# Altium schematic sheet 12V_Power_Supply.SchDoc
size B
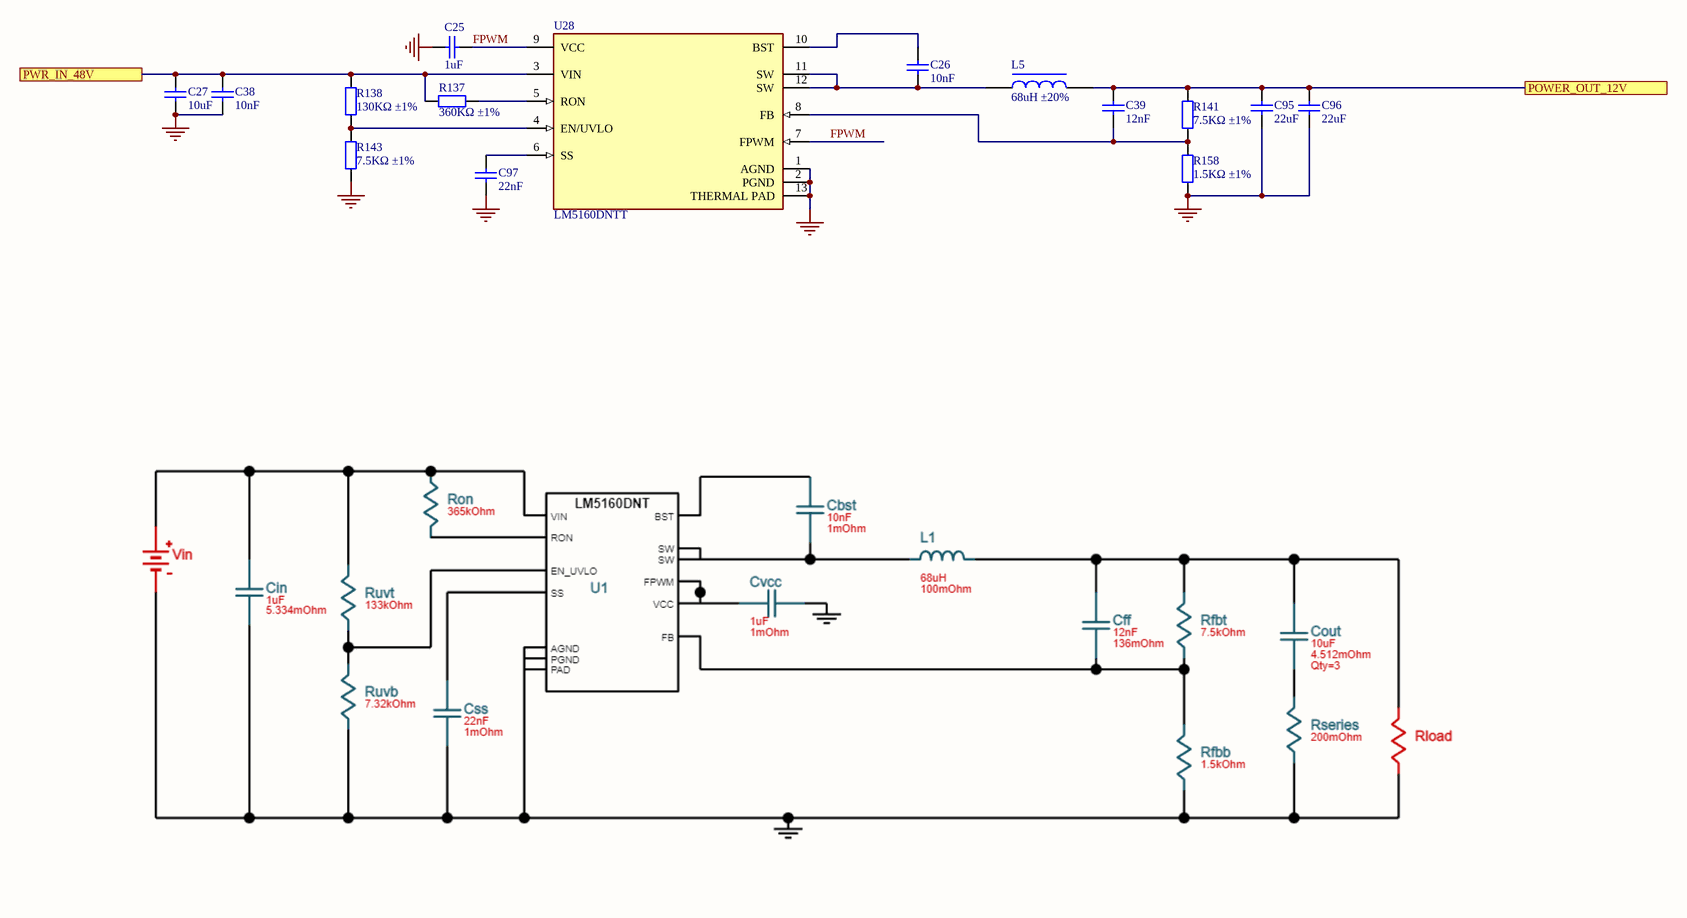
[diagram p0: 12V_Power_Supply.SchDoc]

## Parts
C25  1uF  [0603_C]
C26  10nF  [0603_C]
C27  10uF  [1206_C]
C38  10nF  [0603_C]
C39  12nF  [0603_C]
C95  22uF  [0805_C]
C96  22uF  [0805_C]
C97  22nF  [0603_C]
L5  68uH ±20%  [INDP126126X68N]
R137  360KΩ ±1%  [0603_R]
R138  130KΩ ±1%  [0603_R]
R141  7.5KΩ ±1%  [0603_R]
R143  7.5KΩ ±1%  [0603_R]
R158  1.5KΩ ±1%  [0603_R]
U28  LM5160DNTT  [FP-DNT0012B-MFG]

## Ports
POWER_OUT_12V, PWR_IN_48V

## Nets
GND: C25.1 C27.1 C38.1 C95.1 C96.1 C97.1 R143.1 R158.1 U28.1(AGND) U28.2(PGND) U28.13(THERMAL_PAD)
FPWM: C25.2 U28.7(FPWM) U28.9(VCC)
POWER_OUT_12V: C39.2 C95.2 C96.2 L5.2 R141.2 ; port POWER_OUT_12V
PWR_IN_48V: C27.2 C38.2 R137.1 R138.2 U28.3(VIN) ; port PWR_IN_48V
NetC26_1: C26.1 U28.10(BST)
NetC26_2: C26.2 L5.1 U28.11(SW) U28.12(SW)
NetC39_1: C39.1 R141.1 R158.2 U28.8(FB)
NetC97_2: C97.2 U28.6(SS)
NetR137_2: R137.2 U28.5(RON)
NetR138_1: R138.1 R143.2 U28.4(EN/UVLO)

## Notes on the sheet
- SHEET
- Expatria Technologies
- 1136 Glade Court
- Port Coquitlam, BC V3B 1R5
- PHONE: (778) 238-9336
- PROJECT
- SIZE
- ENGR
- MODIFIED
- DOCUMENT
- REV
- This document contains confidential and proprietary information. No disclosure, reproduction, or transfer of this material in part or in its entirety shall be done without prior written approval.
- EMAIL: INFO@EXPATRIA.CA
- B
- /

## Library data of the parts
C25 = 0603 1uF (105) 10% 50V: Chip capacitors; Manufacturer: Samsung Electro-Mechanics; PartNumber: CL10A105KB8NNNC; Tolerance: 10%; Voltage: 50V; ComponentLink1Description: Supplier link; ComponentLink1URL: http://www.szlcsc.com/product/details_16531.html; Package: 0603; Supplier: LC; SuppliersPartNumber: C15849; Capacitance: 1uF
C26 C38 = 0603 10nF (103) 10% 50V: Chip capacitors; Manufacturer: Guangdong Fenghua Advanced Tech; PartNumber: 0603B103K500NT; Tolerance: 10%; Voltage: 50V; ComponentLink1Description: Supplier link; ComponentLink1URL: http://www.szlcsc.com/product/details_58143.html; Package: 0603; Supplier: LC; SuppliersPartNumber: C57112; Capacitance: 10nF
C27 = 1206 10uF (106) 10% 50V: Chip capacitors; Manufacturer: Samsung Electro-Mechanics; PartNumber: CL31A106KBHNNNE; Tolerance: 10%; Voltage: 50V; ComponentLink1Description: Supplier link; ComponentLink1URL: http://www.szlcsc.com/product/details_14236.html; Package: 1206; Supplier: LC; SuppliersPartNumber: C13585; Capacitance: 10uF
C39 = 0603 12nF (123) 10% 50V: Chip capacitors; Manufacturer: Guangdong Fenghua Advanced Tech; PartNumber: 0603B123K500NT; Tolerance: 10%; Voltage: 50V; ComponentLink1Description: Supplier link; ComponentLink1URL: http://www.szlcsc.com/product/details_1945.html; Package: 0603; Supplier: LC; SuppliersPartNumber: C1593; Capacitance: 12nF
C95 C96 = 0805 22uF (226) 20% 25V: Chip capacitors; Manufacturer: Samsung Electro-Mechanics; PartNumber: CL21A226MAQNNNE; Tolerance: 20%; Voltage: 25V; ComponentLink1Description: Supplier link; ComponentLink1URL: http://www.szlcsc.com/product/details_46786.html; Package: 0805; Supplier: LC; SuppliersPartNumber: C2922481; Capacitance: 22uF
C97 = 0603 22nF (223) 10% 50V: Chip capacitors; Manufacturer: Samsung Electro-Mechanics; PartNumber: CL10B223KB8NNNC; Tolerance: 10%; Voltage: 50V; ComponentLink1Description: Supplier link; ComponentLink1URL: http://www.szlcsc.com/product/details_21834.html; Package: 0603; Supplier: LC; SuppliersPartNumber: C21122; Capacitance: 22nF
L5 = 12.5x12.5x6.5 68uH 20%: 2A 68uH ±20% SMD,12.5x12.5mm Power Inductors ROHS; Package: SMD,12.5x12.5mm; Supplier: LC; SuppliersPartNumber: C693891
R137 = 0603 360K (3603) 1%: Chip resistor; Manufacturer: Uniroyal Elec; PartNumber: 0603WAF3603T5E; Power: 1/10W; ComponentLink1Description: Supplier link; ComponentLink1URL: http://www.szlcsc.com/product/details_23873.html; Package: 0603; Supplier: LC; SuppliersPartNumber: C23146; Resistance: 360KΩ; Tolerance: 1%
R138 = 0603 130K (1303) 1%: Chip resistor; Manufacturer: Uniroyal Elec; PartNumber: 0603WAF1303T5E; Power: 1/10W; ComponentLink1Description: Supplier link; ComponentLink1URL: http://www.szlcsc.com/product/details_23522.html; Package: 0603; Supplier: LC; SuppliersPartNumber: C22795; Resistance: 130KΩ; Tolerance: 1%
R141 R143 = 0603 7.5K (7501) 1%: Chip resistor; Manufacturer: Uniroyal Elec; PartNumber: 0603WAF7501T5E; Power: 1/10W; ComponentLink1Description: Supplier link; ComponentLink1URL: http://www.szlcsc.com/product/details_23961.html; Package: 0603; Supplier: LC; SuppliersPartNumber: C23234; Resistance: 7.5KΩ; Tolerance: 1%
R158 = 0603 1.5K (1501) 1%: Chip resistor; Manufacturer: Uniroyal Elec; PartNumber: 0603WAF1501T5E; Power: 1/10W; ComponentLink1Description: Supplier link; ComponentLink1URL: http://www.szlcsc.com/product/details_23570.html; Package: 0603; Supplier: LC; SuppliersPartNumber: C22843; Resistance: 1.5KΩ; Tolerance: 1%
U28 = CMP-04918-000448-1: IC REG BCK FLYBCK ADJ 12WSON; Min Input Voltage: 4.5V; Operating Supply Current: 2.3mA; Output Current: 1.5A; Number of Outputs: 1; Topology: Flyback; Synchronous Rectifier: Yes; Output Type: Adjustable; Max Input Voltage: 65V; Min Output Voltage: 2V; Switching Frequency: 1MHz; Output Voltage: 60V; Mount: Surface Mount; Min Operating Temperature: -40°C; Package Quantity: 250; Min Supply Voltage: 4.5V; Max Operating Temperature: 125°C; RoHS Compliant: Yes; Contact Plating: Tin; Height: 0.8mm; Packaging: Tape and Reel; Quiescent Current: 2.3mA; Lead Free: Lead Free; Number of Pins: 12; Max Output Current: 1.5A; REACH SVHC: No SVHC; Width: 4mm; Operating Supply Voltage: 65V; Max Output Voltage: 60V; Length: 4mm; SuppliersPartNumber: C473375